# EAGLE schematic roller_sensor (EAGLE 4.16)
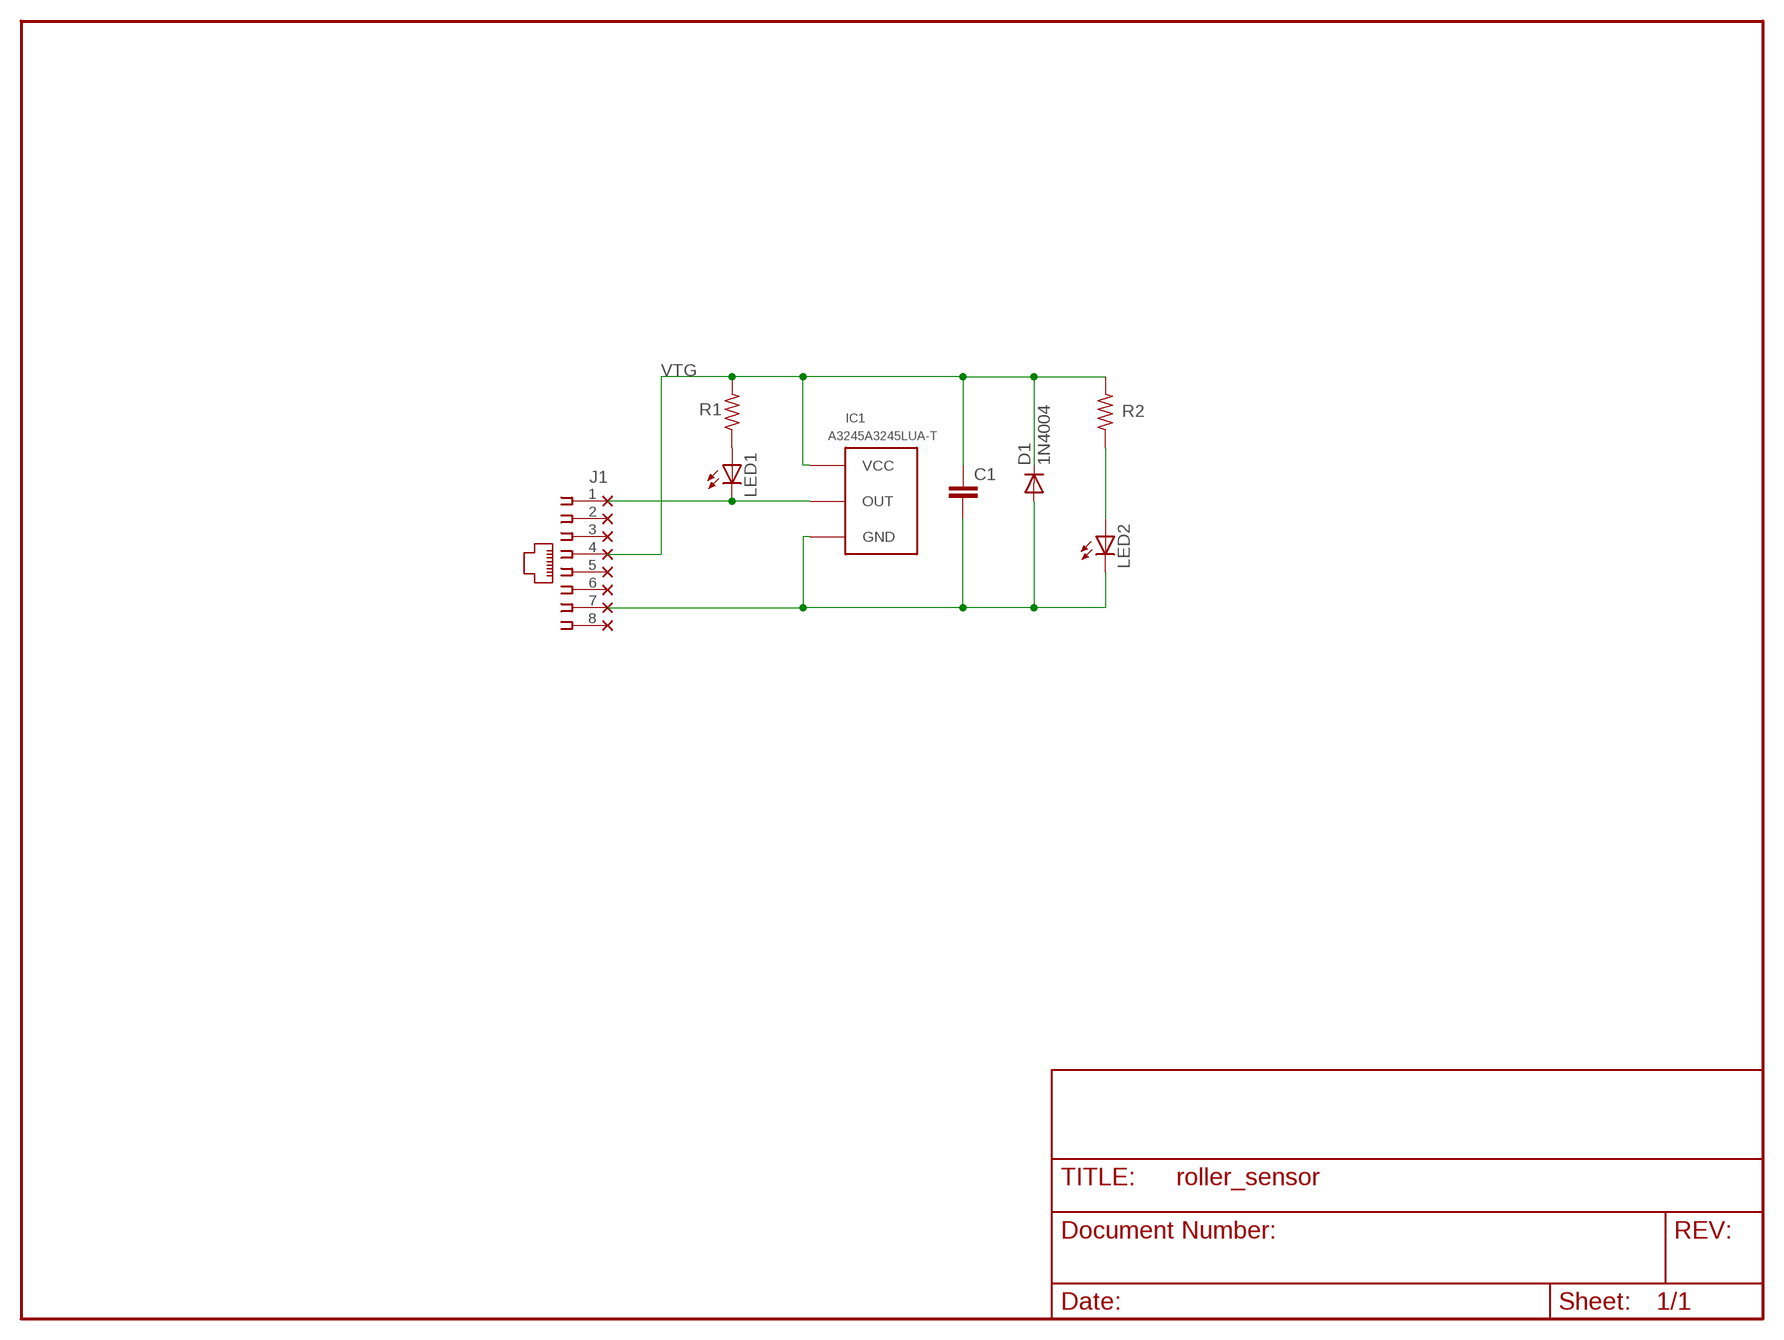
[diagram p0: schematic, sheet 1]

## Parts
C1  C-EU025-025X050  [C025-025X050]
D1  1N4004  [DO41-10]
IC1  A3245A3245LUA-T  [A3245]
J1  555164-1  [555164-1]
LED1  LED5MM  [LED5MM]
LED2  LED3MM  [LED3MM]
R1  R-US_0309/V  [0309V]
R2  R-US_0309/V  [0309V]
U$1  THRUHOLETHUHOLE_1  [THRUHOLE_1]
U$2  THRUHOLETHRUHOLE_X  [THRUHOLE]
U$3  THRUHOLETHRUHOLE_X  [THRUHOLE]
U$4  THRUHOLETHRUHOLE_X  [THRUHOLE]
U$5  THRUHOLETHRUHOLE_X  [THRUHOLE]
U$6  THRUHOLETHRUHOLE_X  [THRUHOLE]
U$7  THRUHOLETHRUHOLE_X  [THRUHOLE]
U$8  THRUHOLETHRUHOLE_X  [THRUHOLE]

## Nets
GND: C1.2 D1.A IC1.P$3(GND) J1.7 LED2.K(C)
N$1: LED2.A R2.1
N$2: LED1.A R1.1
OUT: IC1.P$2(OUT) J1.1 LED1.K(C)
VTG: C1.1 D1.C IC1.P$1(VCC) J1.4 R1.2 R2.2
Unconnected: J1.2 J1.3 J1.5 J1.6 J1.8 U$1.P$1 U$2.P$1 U$3.P$1 U$4.P$1 U$5.P$1 U$6.P$1 U$7.P$1 U$8.P$1

## Library data of the parts
C1 = rcl:C-EU: CAPACITOR, European symbol
D1 = diode:1N4004: DIODE general purpose rectifier, 1 A
IC1 = roller_sensor:A3245
J1 = roller_sensor:555164-1: AMP connector
LED1 LED2 = led:LED: LED OSRAM: - CHIPLED LG R971, LG N971, LY N971, LG Q971, LY Q971, LO R971, LY R971 LH N974, LH R974 LS Q976, LO Q976, LY Q976 LO Q996 - Hyper CHIPLED LW Q18S LB Q993, LB Q99A, LB R99A - SideLED LS A670, LO A670, LY A670, LG A670, LP A670 LB A673, LV A673, LT A673, LW A673 LH A674 LY A675 LS A676, LA A676, LO A676, LY A676, LW A676 LS A679, LY A679, LG A679 - Hyper Micro SIDELED® LS Y876, LA Y876, LO Y876, LY Y876 LT Y87S - SmartLED LW L88C, LW L88S LB L89C, LB L89S, LG L890 LS L89K, LO L89K, LY L89K LS L896, LA L896, LO L896, LY L896 - TOPLED LS T670, LO T670, LY T670, LG T670, LP T670 LSG T670, LSP T670, LSY T670, LOP T670, LYG T670 LG T671, LOG T671, LSG T671 LB T673, LV T673, LT T673, LW T673 LH T674 LS T676, LA T676, LO T676, LY T676, LB T676, LH T676, LSB T676, LW T676 LB T67C, LV T67C, LT T67C, LS T67K, LO T67K, LY T67K, LW E67C LS E67B, LA E67B, LO E67B, LY E67B, LB E67C, LV E67C, LT E67C LW T67C LS T679, LY T679, LG T679 LS T770, LO T770, LY T770, LG T770, LP T770 LB T773, LV T773, LT T773, LW T773 LH T774 LS E675, LA E675, LY E675, LS T675 LS T776, LA T776, LO T776, LY T776, LB T776 LHGB T686 LT T68C, LB T68C - Hyper Mini TOPLED® LB M676 - Mini TOPLED Santana® LG M470 LS M47K, LO M47K, LY M47K Source: http://www.osram.convergy.de - LUMILED® LXK2-PW12-R00, LXK2-PW12-S00, LXK2-PW14-U00, LXK2-PW14-V00 LXK2-PM12-R00, LXK2-PM12-S00, LXK2-PM14-U00 LXK2-PE12-Q00, LXK2-PE12-R00, LXK2-PE12-S00, LXK2-PE14-T00, LXK2-PE14-U00 LXK2-PB12-K00, LXK2-PB12-L00, LXK2-PB12-M00, LXK2-PB14-N00, LXK2-PB14-P00, LXK2-PB14-Q00 LXK2-PR12-L00, LXK2-PR12-M00, LXK2-PR14-Q00, LXK2-PR14-R00 LXK2-PD12-Q00, LXK2-PD12-R00, LXK2-PD12-S00 LXK2-PH12-R00, LXK2-PH12-S00 LXK2-PL12-P00, LXK2-PL12-Q00, LXK2-PL12-R00 Source: www.luxeon.com
R1 R2 = rcl:R-US_: RESISTOR, American symbol
U$1-U$8 = roller_sensor:THRUHOLE